# EasyEDA Pro project 轮足机器人主板&核心板.epro, schematic 卡座主板原理图
Board Name: 卡座主板; Create Date: 2024-11-25; Page Name: P1; Project Name: 轮足机器人; Schematic Name: 卡座主板原理图; Update Date: 2025-02-25; Company: 嘉立创EDA; Page Size: A4; Version: V0.1
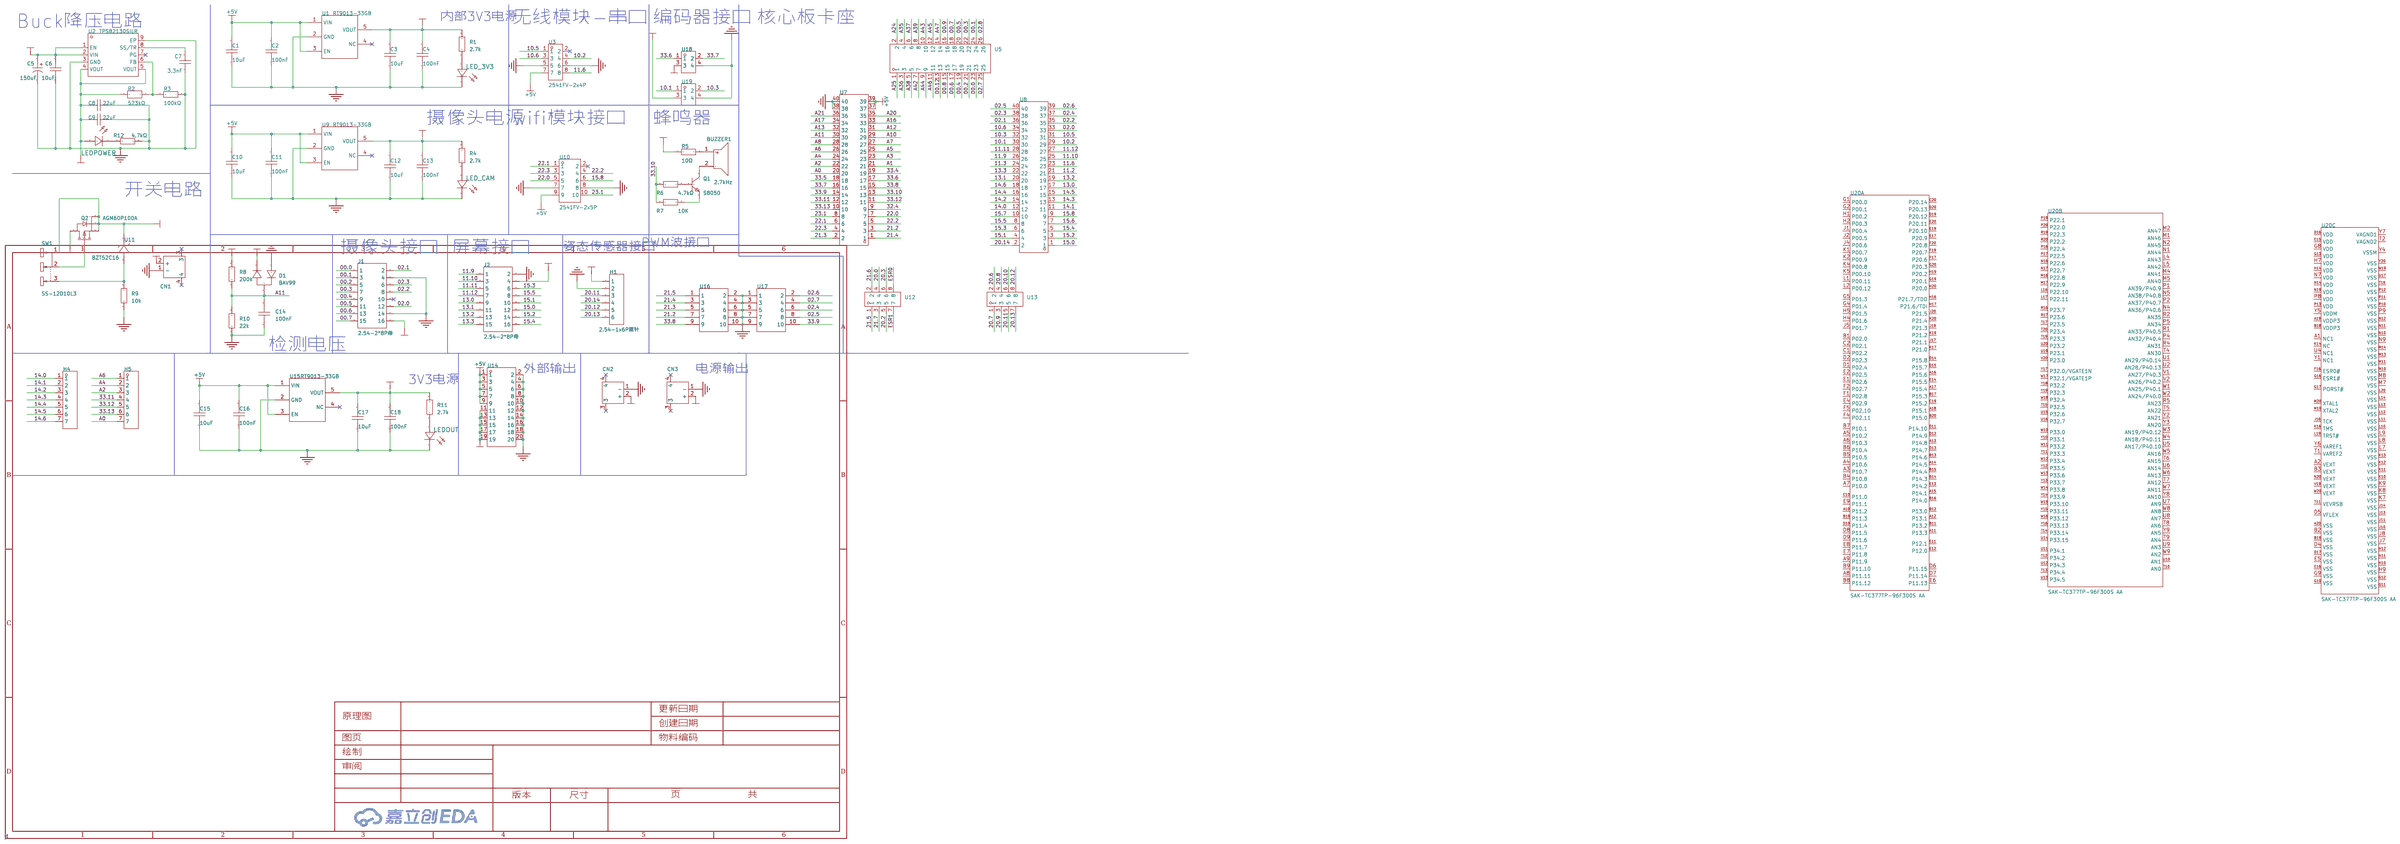
[diagram p2: schematic sheet]

## Parts
BUZZER1  2.7kHz  [BUZ-TH_BD9.0-P4.00-D0.6-FD]
C1  10uF  [C1206]
C2  100nF  [C0603]
C3  10uF  [C1206]
C4  100nF  [C0603]
C5  150uF  [CAP-TH_BD6.3-P2.50-D0.5-FD]
C6  10uF  [C1206]
C7  3.3nF  [C0603]
C8  22uF  [C0805]
C9  22uF  [C0805]
C10  10uF  [C1206]
C11  100nF  [C0603]
C12  10uF  [C1206]
C13  100nF  [C0603]
C14  100nF  [C0603]
C15  10uF  [C1206]
C16  100nF  [C0603]
C17  10uF  [C1206]
C18  100nF  [C0603]
CN1  XT30PW-M30.G.Y  [CONN-TH_XT30PW-M]
CN2  XT30PW-M30.G.Y  [CONN-TH_XT30PW-M]
CN3  XT30PW-M30.G.Y  [CONN-TH_XT30PW-M]
D1  BAV99  [SOT-23_L2.9-W1.3-P1.90-LS2.4-BR]
H1  2.54-1x6P直针  [HDR-TH_6P-P2.54-V-M-1]
H4  PZ254V-11-07P  [HDR-TH_7P-P2.54-V-M]
H5  PZ254V-11-07P  [HDR-TH_7P-P2.54-V-M]
J1  2.54-2*8P母  [HDR-TH_16P-P2.54-V-F-R2-C8-S2.54]
J2  2.54-2*8P母  [HDR-TH_16P-P2.54-V-F-R2-C8-S2.54]
LED_3V3  -  [LED_0603]
LED_CAM  -  [LED_0603]
LEDOUT  -  [LED_0603]
LEDPOWER  -  [LED_0603]
Q1  S8050  [SOT-23-3_L2.9-W1.6-P1.90-LS2.8-BR]
Q2  AGM60P100A  [TDSON-8_L5.9-W5.2-P1.27-BL]
R1  2.7k  [R0603]
R2  523kΩ  [R0603]
R3  100kΩ  [R0603]
R4  2.7k  [R0603]
R5  10Ω  [R0603]
R6  4.7kΩ  [R0603]
R7  10K  [R0603]
R8  200k  [R0603]
R9  10k  [R0603]
R10  22k  [R0603]
R11  2.7k  [R0603]
R12  4.7kΩ  [R0805]
SW1  SS-12D10L3  [SW-TH_SS-12D10L3]
U1  RT9013-33GB  [SOT-23-5_L3.0-W1.7-P0.95-LS2.8-BL]
U2  TPS82130SILR  [USIP-8_L3.0-W2.8-P0.65-TL-EP]
U3  2541FV-2x4P  [HDR-TH_8P-P2.54-V-F-R2-C4-S2.54]
U5  PM254-2-13-Z-8.5  [HDR-TH_26P-P2.54-V-F-R2-C13-S2.54-1]
U7  PM254-2-20-Z-8.5  [HDR-TH_40P-P2.54-V-F-R2-C20-S2.54]
U8  PM254-2-20-Z-8.5  [HDR-TH_40P-P2.54-V-F-R2-C20-S2.54]
U9  RT9013-33GB  [SOT-23-5_L3.0-W1.7-P0.95-LS2.8-BL]
U10  2541FV-2x5P  [HDR-TH_10P-P2.54-V-F-R2-C5-S2.54]
U11  BZT52C16  [SOD-123_L2.7-W1.6-LS3.8-RD]
U12  PM254-2-04-Z-8.5  [HDR-TH_8P-P2.54-V-F-R2-C4-S2.54]
U13  PM254-2-04-Z-8.5  [HDR-TH_8P-P2.54-V-F-R2-C4-S2.54]
U14  2541WV-2x10P  [HDR-TH_20P-P2.54-V-M-R2-C10-S2.54]
U15  RT9013-33GB  [SOT-23-5_L3.0-W1.7-P0.95-LS2.8-BL]
U16  A2541WV-2x5P  [HDR-TH_10P-P2.54-V-M-R2-C5-S2.54-1]
U17  A2541WV-2x5P  [HDR-TH_10P-P2.54-V-M-R2-C5-S2.54-1]
U18  KH-2.54PH180-2X2P-L11.5  [HDR-TH_4P-P2.54-V-M-R2-C2-S2.54]
U19  KH-2.54PH180-2X2P-L11.5  [HDR-TH_4P-P2.54-V-M-R2-C2-S2.54]
U20  SAK-TC377TP-96F300S AA  [PG-LFBGA-292_L17.0-W17.0-BL_SAK-TC1791F]  (sections 1,2,3)

## Library data of the parts
BUZZER1 = QMB-09B-03: 驱动方式:无源(外部驱动);构造类型:电磁式;频率:2.7kHz;声压(SPL):85dB@3V,10cm;; LCSC Part Name: 无源蜂鸣器QMB-09B-03; Supplier Part: C96256; Manufacturer: 华能; Supplier Footprint: 插件,D=9mm; JLCPCB Part Class: 扩展库; Datasheet: https://atta.szlcsc.com/upload/public/pdf/source/20210401/C96256_958B17753B5AD7CBFBCFFC7C095B4484.pdf; Supplier: LCSC; Oscillator Circuit: 无源(外部驱动); Technology Type: 电磁式; Operating Voltage: 2V~5V; Sound Pressure Level (SPL): 85dB@3V,10cm; Diameter (φD): 9mm; Height: 5.7mm
C1 C3 C6 C10 C12 C15 C17 = HGC1206R5106K500NSPJ: 容值:10uF;精度:±10%;额定电压:50V;材质(温度系数):X5R;; LCSC Part Name: 10uF ±10% 50V; Supplier Part: C7432781; Manufacturer: Chinocera(华瓷); Supplier Footprint: 1206; JLCPCB Part Class: 扩展库; Datasheet: https://atta.szlcsc.com/upload/public/pdf/source/20240320/FAC3FEC40A78BC5CCCE96C232A94D860.pdf; Supplier: LCSC; Tolerance: ±10%; Voltage Rated: 50V; Temperature Coefficient: X5R
C2 C4 C11 C13 C16 C18 = CC0603KRX7R9BB104: 容值:100nF;精度:±10%;额定电压:50V;材质(温度系数):X7R;; LCSC Part Name: 100nF ±10% 50V; Supplier Part: C14663; Manufacturer: YAGEO(国巨); Supplier Footprint: 0603; JLCPCB Part Class: 基础库; Datasheet: https://atta.szlcsc.com/upload/public/pdf/source/20180910/C282072_33301C7F631E79921B82A8DAC6BCC5B3.pdf; Supplier: LCSC; Tolerance: ±10%; Voltage Rated: 50V; Temperature Coefficient: X7R
C5 = HG1V157M0609PC: 容值:150uF;精度:±20%;额定电压:35V;纹波电流:2.55A;等效串联电阻:38mΩ;; LCSC Part Name: 150uF ±20% 35V; Supplier Part: C5438852; Manufacturer: HONOR(荣誉); Supplier Footprint: 插件,D6.3xL9mm; JLCPCB Part Class: 扩展库; Datasheet: https://atta.szlcsc.com/upload/public/pdf/source/20230323/E6B46A248FBB182638B68380B3289E6D.pdf; Supplier: LCSC; Tolerance: ±20%; Rated Voltage: 35V; Ripple Current: 2.55A; Equivalent Series Resistance(ESR): 38mΩ; Lead Spacing: 2.5mm; φD: 6.3mm; L: 9mm; Lifetime @ Temp: 2000hrs@105℃; Operating Temperature: -55℃~+105℃
C7 = CL10B332KB8NNNC: 容值:3.3nF;精度:±10%;额定电压:50V;材质(温度系数):X7R;; LCSC Part Name: 3.3nF ±10% 50V; Supplier Part: C1613; Manufacturer: SAMSUNG(三星); Supplier Footprint: 0603; JLCPCB Part Class: 基础库; Datasheet: https://atta.szlcsc.com/upload/public/pdf/source/20160218/1457707763339.pdf; Supplier: LCSC; Tolerance: ±10%; Voltage Rated: 50V; Temperature Coefficient: X7R
C8 C9 = GRM21BR61E226ME44L: 容值:22uF;精度:±20%;额定电压:25V;材质(温度系数):X5R;; LCSC Part Name: 22uF ±20% 25V; Supplier Part: C86816; Manufacturer: muRata(村田); Supplier Footprint: 0805; JLCPCB Part Class: 扩展库; Datasheet: https://atta.szlcsc.com/upload/public/pdf/source/20161226/1482720145536.pdf; Supplier: LCSC; Tolerance: ±20%; Voltage Rated: 25V; Temperature Coefficient: X5R
C14 = CAP_0603: Supplier Footprint: 0603
CN1-CN3 = XT30PW-M30.G.Y: 类别:-;类型1:-;; LCSC Part Name: AMASS(艾迈斯)航模插头 卧式弯脚 XT30PW-M公头; Supplier Part: C431092; Manufacturer: AMASS(艾迈斯); JLCPCB Part Class: 扩展库; Datasheet: https://atta.szlcsc.com/upload/public/pdf/source/20220222/6A9F22F7850E25B33E1BE430ADF8560B.pdf; Supplier: LCSC; Type: 航模插头; RatedVoltage: DC 500V; InterfaceType: 公头; RatedCurrent: 15A; RecommendedWireGauge: 16/18/20AWG; contact resistance: 1.2mΩ; specifications: 2pin
D1 = BAV99_C408392: 二极管配置:1对串联式;正向压降(Vf):1.25V@150mA;直流反向耐压(Vr):70V;整流电流:200mA;反向恢复时间(trr):6ns;; LCSC Part Name: 电压:70V 电流:200mA; Supplier Part: C408392; Manufacturer: MDD(辰达半导体); Supplier Footprint: SOT-23; JLCPCB Part Class: 扩展库; Datasheet: https://atta.szlcsc.com/upload/public/pdf/source/20240710/712A41600A6652723ABF2FD56C16FE3C.pdf; Supplier: LCSC; Diode Configuration: 1对串联式; Forward Voltage (Vf@If): 1.25V@150mA; Reverse Voltage (Vr): 70V; Rectified Current: 200mA; Reverse Leakage Current: 2.5uA@70V; Reverse Recovery Time (trr): 6ns
H1 = 2.54-1x6P直针: 插针结构:1x6P;间距:2.54mm;行距:-;圆针/方针:方针;安装类型:直插;排数:单排;总PIN位数:6P;额定电流:3A;额定电压:-;配合针长度:-;塑高:-;触头材质:黄铜;触头镀层:-;工作温度范围:-40℃~+105℃;颜色:黑色;; LCSC Part Name: 间距:2.54mm 1x6P 直插 方针; Supplier Part: C37208; Manufacturer: BOOMELE(博穆精密); Supplier Footprint: 插件,P=2.54mm; JLCPCB Part Class: 扩展库; Supplier: LCSC; Pin Structure: 1x6P; Pitch: 2.54mm; Circluar Pins/Square Pins: 方针; Mounting Type: 直插; Number of Rows: 单排; Number of Pins: 6P; Current Rating (Max): 3A; Contact Material: 黄铜; Operating Temperature Range: -40℃~+105℃; Color: 黑色
H4 H5 = PZ254V-11-07P: 插针结构:1x7P;间距:2.54mm;行距:-;圆针/方针:方针;安装类型:直插;排数:单排;总PIN位数:7P;额定电流:-;额定电压:-;配合针长度:6mm;塑高:2.5mm;端接针长度:3mm;触头材质:黄铜;触头镀层:-;工作温度范围:-40℃~+105℃;颜色:黑色;; LCSC Part Name: 间距:2.54mm 1x7P 直插 方针; Supplier Part: C492406; Manufacturer: XFCN(兴飞); Supplier Footprint: 插件,P=2.54mm; JLCPCB Part Class: 扩展库; Datasheet: https://atta.szlcsc.com/upload/public/pdf/source/20200309/C492406_654C533EE691117E22DD9F76C114C2D9.pdf; Supplier: LCSC; Pin Structure: 1x7P; Pitch: 2.54mm; Circluar Pins/Square Pins: 方针; Mounting Type: 直插; Number of Rows: 单排; Number of Pins: 7P; Length of Mating Pin: 6mm; Insulation Height: 2.5mm; Length of End Connection Pin: 3mm; Contact Material: 黄铜; Operating Temperature Range: -40℃~+105℃; Color: 黑色
J1 J2 = 2.54-2*8P母: 插孔结构:2x8P;间距:2.54mm;行距:2.54mm;安装类型:直插;排数:双排;总孔位数:16P;塑高:-;触头材质:黄铜;触头镀层:-;; LCSC Part Name: 间距:2.54mm 2x8P 直插; Supplier Part: C30734; Manufacturer: BOOMELE(博穆精密); Supplier Footprint: 插件,P=2.54mm; JLCPCB Part Class: 扩展库; Datasheet: https://atta.szlcsc.com/upload/public/pdf/source/20230817/400B44B2F3F98035DBB6B63900A9163B.pdf; Supplier: LCSC; Holes Structure: 2x8P; Pitch: 2.54mm; Row Spacing: 2.54mm; Mounting Type: 直插; Number of Rows: 双排; Number of Holes: 16P; Contact Material: 黄铜
LED_3V3 LED_CAM LEDOUT LEDPOWER = LED_0603-R: Supplier Footprint: 0603
Q1 = S8050_C181158: 晶体管类型:NPN;集电极电流(Ic):500mA;集射极击穿电压(Vceo):25V;功率(Pd):300mW;; LCSC Part Name: NPN 电流:500mA 耐压:25V; Supplier Part: C181158; Manufacturer: Hottech(合科泰); Supplier Footprint: SOT-23; JLCPCB Part Class: 扩展库; Datasheet: https://atta.szlcsc.com/upload/public/pdf/source/20220506/D987F39D56F2975D34EC7947E75C4ABC.pdf; Supplier: LCSC; Transistor Type: NPN; Collector Current (Ic): 500mA; Collector-Emitter Breakdown Voltage (Vceo): 25V; Power Dissipation (Pd): 300mW; Transition Frequency (fT): 150MHz; Collector Cut-Off Current (Icbo): 100nA; Collector-Emitter Saturation Voltage (VCE(sat)@Ic,Ib): 600mV@500mA,50mA
Q2 = AGM60P100A: 类型:1个P沟道;漏源电压(Vdss):60V;连续漏极电流(Id):100A;导通电阻(RDS(on)@Vgs,Id):5.5mΩ@10V,15A;功率(Pd):150W;阈值电压(Vgs(th)@Id):2V@250uA;; LCSC Part Name: 1个P沟道 耐压:60V 电流:100A; Supplier Part: C5373096; Manufacturer: AGM-Semi(芯控源); Supplier Footprint: PDFN-8(5x6); JLCPCB Part Class: 扩展库; Datasheet: https://atta.szlcsc.com/upload/public/pdf/source/20241108/A068B77F4A82E836D758702AA2819D88.pdf; Supplier: LCSC; Type: 1个P沟道; Drain Source Voltage (Vdss): 60V; Continuous Drain Current (Id): 100A; Drain Source On Resistance (RDS(on)@Vgs,Id): 5.5mΩ@10V,15A; Power Dissipation (Pd): 150W; Gate Threshold Voltage (Vgs(th)@Id): 2V@250uA; Total Gate Charge (Qg@Vgs): 56nC@10V; Operating Temperature: -55℃~+150℃@(Tj)
R1 R4 R7-R11 = Res_0603: Supplier Footprint: 0603
R2 = FRC0603F5233TS: 电阻类型:厚膜电阻;阻值:523kΩ;精度:±1%;功率:100mW;最大工作电压:75V;温度系数:±100ppm/℃;; LCSC Part Name: 523kΩ ±1% 100mW 厚膜电阻; Supplier Part: C5126197; Manufacturer: FOJAN(富捷); Supplier Footprint: 0603; JLCPCB Part Class: 扩展库; Datasheet: https://atta.szlcsc.com/upload/public/pdf/source/20211221/925EC7D7225764EE0046F22065062C87.pdf; Supplier: LCSC; Type: 厚膜电阻; Tolerance: ±1%; Power(Watts): 100mW; Overload Voltage (Max): 75V; Temperature Coefficient: ±100ppm/℃
R3 = RC0603FR-07100KL: 电阻类型:厚膜电阻;阻值:100kΩ;精度:±1%;功率:100mW;最大工作电压:75V;温度系数:±100ppm/℃;; LCSC Part Name: 厚膜电阻 100kΩ ±1% 100mW; Supplier Part: C14675; Manufacturer: YAGEO(国巨); Supplier Footprint: 0603; JLCPCB Part Class: 扩展库; Datasheet: https://atta.szlcsc.com/upload/public/pdf/source/20140324/1457707028752.pdf; Supplier: LCSC; Type: 厚膜电阻; Tolerance: ±1%; Power(Watts): 100mW; Overload Voltage (Max): 75V; Temperature Coefficient: ±100ppm/℃; Operating Temperature Range: -55℃~+155℃
R5 = 0603WAF100JT5E: 电阻类型:厚膜电阻;阻值:10Ω;精度:±1%;功率:100mW;最大工作电压:75V;温度系数:±400ppm/℃;; LCSC Part Name: 10Ω ±1% 100mW 厚膜电阻; Supplier Part: C22859; Manufacturer: UNI-ROYAL(厚声); Supplier Footprint: 0603; JLCPCB Part Class: 基础库; Datasheet: https://atta.szlcsc.com/upload/public/pdf/source/20200306/C422600_1E6D84923E4A46A82E41ADD87F860B5C.pdf; Supplier: LCSC; Type: 厚膜电阻; Tolerance: ±1%; Power(Watts): 100mW; Overload Voltage (Max): 75V; Temperature Coefficient: ±400ppm/℃; Operating Temperature Range: -55℃~+155℃
R6 = 0603WAF4701T5E: 电阻类型:厚膜电阻;阻值:4.7kΩ;精度:±1%;功率:100mW;最大工作电压:75V;温度系数:±100ppm/℃;; LCSC Part Name: 4.7kΩ ±1% 100mW 厚膜电阻; Supplier Part: C23162; Manufacturer: UNI-ROYAL(厚声); Supplier Footprint: 0603; JLCPCB Part Class: 基础库; Datasheet: https://atta.szlcsc.com/upload/public/pdf/source/20200306/C422600_1E6D84923E4A46A82E41ADD87F860B5C.pdf; Supplier: LCSC; Type: 厚膜电阻; Tolerance: ±1%; Power(Watts): 100mW; Overload Voltage (Max): 75V; Temperature Coefficient: ±100ppm/℃; Operating Temperature Range: -55℃~+155℃
R12 = 0805W8F4701T5E: 电阻类型:厚膜电阻;阻值:4.7kΩ;精度:±1%;功率:125mW;最大工作电压:150V;温度系数:±100ppm/℃;; LCSC Part Name: 4.7kΩ ±1% 125mW 厚膜电阻; Supplier Part: C17673; Manufacturer: UNI-ROYAL(厚声); Supplier Footprint: 0805; JLCPCB Part Class: 基础库; Datasheet: https://atta.szlcsc.com/upload/public/pdf/source/20200306/C422600_1E6D84923E4A46A82E41ADD87F860B5C.pdf; Supplier: LCSC; Type: 厚膜电阻; Tolerance: ±1%; Power(Watts): 125mW; Overload Voltage (Max): 150V; Temperature Coefficient: ±100ppm/℃; Operating Temperature Range: -55℃~+155℃
SW1 = SS-12D10L3: 电路结构:单刀双掷;安装方式:直插;开关颜色:黑色;额定电流(DC):3A;额定电压(DC):125V;额定电流(AC):3A;额定电压(AC):125V;机械寿命:1万次;; LCSC Part Name: 柄长3mm 直插双档 滑动开关; Supplier Part: C319013; Manufacturer: XKB Connectivity(中国星坤); Supplier Footprint: 插件; JLCPCB Part Class: 扩展库; Datasheet: https://atta.szlcsc.com/upload/public/pdf/source/20211009/D6412F37AABE6F9459A6EE7FA4DAEADB.pdf; Supplier: LCSC; Circuit: 单刀双掷; Actuator Style: 矩形柱状; Pin Style: PC引脚; Switch Length: 13mm; Switch Width: 6.8mm; Switch Height: 6.4mm; Mounting Style: 直插; Actuator Color: 黑色; Current Rating (DC): 3A; Voltage Rating (DC): 125V; Current Rating (AC): 3A; Voltage Rating (AC): 125V; Mechanical Life: 1万次; Operating Temperature: -40℃~+85℃
U1 U9 U15 = RT9013-33GB: 输出类型:固定;最大输入电压:5.5V;输出电压:3.3V;最大输出电流:500mA;电源纹波抑制比(PSRR):50dB@(10kHz);输出极性:正极;; LCSC Part Name: 输入5.5V 输出3.3V 500mA; Supplier Part: C47773; Manufacturer: RICHTEK(立锜); Supplier Footprint: SOT-23-5; JLCPCB Part Class: 扩展库; Datasheet: https://atta.szlcsc.com/upload/public/pdf/source/20150504/1457707282459.pdf; Supplier: LCSC; Output Type: 固定; Maximum Input Voltage: 5.5V; Output Voltage: 3.3V; MAX Output Current: 500mA; Power Supply Rejection Ratio (PSRR): 50dB@(10kHz); Dropout Voltage: 400mV@(500mA); standby current: 50uA; Operating Temperature: -40℃~+85℃; Output Polarity: 正极; Number of Outputs: 1
U2 = TPS82130SILR: TPS82130 TPS82130 具有集成电感的 3A 17V 降压转换器; Supplier Part: C473914; Manufacturer: TI(德州仪器); Supplier Footprint: USIP-8; JLCPCB Part Class: 扩展库; Datasheet: https://www.ti.com/cn/lit/gpn/tps82130; Supplier: LCSC
U3 = 2541FV-2x4P: 插孔结构:2x4P;间距:2.54mm;圆孔/方孔:方孔;安装类型:直插;排数:双排;总孔位数:8P;额定电流:3A;额定电压:250V;插孔方向:顶部;工作温度范围:-40℃~+105℃;; LCSC Part Name: 间距:2.54mm 2x4P 直插; Supplier Part: C18723055; Manufacturer: HanElectricity(瀚源); Supplier Footprint: 插件,P=2.54mm; JLCPCB Part Class: 扩展库; Datasheet: https://atta.szlcsc.com/upload/public/pdf/source/20231018/348A30CBB18FAA04E40F2CE12A6EAA75.pdf; Supplier: LCSC; Holes Structure: 2x4P; Pitch: 2.54mm; Circular Hole / Square Hole: 方孔; Mounting Type: 直插; Number of Rows: 双排; Number of Holes: 8P; Current Rating (Max): 3A; Voltage Rating (Max): 250V; Holes Direction: 顶部; Operating Temperature Range: -40℃~+105℃
U5 = PM254-2-13-Z-8.5: 插孔结构:2x13P;间距:2.54mm;行距:2.54mm;圆孔/方孔:方孔;安装类型:直插;排数:双排;总孔位数:26P;额定电流:3A;额定电压:-;插孔方向:顶部;塑高:8.5mm;触头材质:铜合金;工作温度范围:-40℃~+105℃;焊接温度(最大值):260℃@5S;; LCSC Part Name: 2x13P 间距:2.54mm 直插; Supplier Part: C2897414; Manufacturer: HCTL(华灿天禄); Supplier Footprint: 插件,P=2.54mm; JLCPCB Part Class: 扩展库; Datasheet: https://atta.szlcsc.com/upload/public/pdf/source/20230609/3D36CA2C1BFC9FD1C3F709AD9DFEB9C2.pdf; Supplier: LCSC; Holes Structure: 2x13P; Pitch: 2.54mm; Row Spacing: 2.54mm; Circular Hole / Square Hole: 方孔; Mounting Type: 直插; Number of Rows: 双排; Number of Holes: 26P; Current Rating (Max): 3A; Holes Direction: 顶部; Insulation Height: 8.5mm; Contact Material: 铜合金; Operating Temperature Range: -40℃~+105℃; Soldering Temperature(Max): 260℃@5S
U7 U8 = PM254-2-20-Z-8.5: 插孔结构:2x20P;间距:2.54mm;行距:2.54mm;圆孔/方孔:方孔;安装类型:直插;排数:双排;总孔位数:40P;额定电流:3A;额定电压:-;插孔方向:顶部;塑高:8.5mm;触头材质:铜合金;工作温度范围:-40℃~+105℃;焊接温度(最大值):260℃@5S;; LCSC Part Name: 2x20P 间距:2.54mm 直插; Supplier Part: C2897421; Manufacturer: HCTL(华灿天禄); Supplier Footprint: 插件,P=2.54mm; JLCPCB Part Class: 扩展库; Datasheet: https://atta.szlcsc.com/upload/public/pdf/source/20230609/3D36CA2C1BFC9FD1C3F709AD9DFEB9C2.pdf; Supplier: LCSC; Holes Structure: 2x20P; Pitch: 2.54mm; Row Spacing: 2.54mm; Circular Hole / Square Hole: 方孔; Mounting Type: 直插; Number of Rows: 双排; Number of Holes: 40P; Current Rating (Max): 3A; Holes Direction: 顶部; Insulation Height: 8.5mm; Contact Material: 铜合金; Operating Temperature Range: -40℃~+105℃; Soldering Temperature(Max): 260℃@5S
U10 = 2541FV-2x5P: 插孔结构:2x5P;间距:2.54mm;圆孔/方孔:方孔;安装类型:直插;排数:双排;总孔位数:10P;额定电流:3A;额定电压:250V;插孔方向:顶部;工作温度范围:-40℃~+105℃;; LCSC Part Name: 间距:2.54mm 2x5P 直插; Supplier Part: C18723056; Manufacturer: HanElectricity(瀚源); Supplier Footprint: 插件,P=2.54mm; JLCPCB Part Class: 扩展库; Datasheet: https://atta.szlcsc.com/upload/public/pdf/source/20231018/348A30CBB18FAA04E40F2CE12A6EAA75.pdf; Supplier: LCSC; Holes Structure: 2x5P; Pitch: 2.54mm; Circular Hole / Square Hole: 方孔; Mounting Type: 直插; Number of Rows: 双排; Number of Holes: 10P; Current Rating (Max): 3A; Voltage Rating (Max): 250V; Holes Direction: 顶部; Operating Temperature Range: -40℃~+105℃
U11 = BZT52C16_C2903915: 二极管配置:独立式;稳压值(标称值):16V;稳压值(范围):15.3V~17.1V;功率(Pd):500mW;; Supplier Part: C2903915; Manufacturer: GOODWORK(固得沃克); Supplier Footprint: SOD-123; JLCPCB Part Class: 扩展库; Datasheet: https://atta.szlcsc.com/upload/public/pdf/source/20211009/D2D840BC467623069B519162AA0DC941.pdf; Supplier: LCSC; Diode Configuration: 独立式; Zener Voltage (Nom): 16V; Reverse Leakage Current (Ir): 100nA@11.2V; Zener Voltage (Range): 15.3V~17.1V; Power Dissipation: 500mW; Zener Impedance (Zzt): 40Ω
U12 U13 = PM254-2-04-Z-8.5: 插孔结构:2x4P;间距:2.54mm;行距:2.54mm;圆孔/方孔:方孔;安装类型:直插;排数:双排;总孔位数:8P;额定电流:3A;额定电压:-;插孔方向:顶部;塑高:8.5mm;触头材质:铜合金;工作温度范围:-40℃~+105℃;焊接温度(最大值):260℃@5S;; LCSC Part Name: 2x4P 间距:2.54mm 直插; Supplier Part: C2897405; Manufacturer: HCTL(华灿天禄); Supplier Footprint: 插件,P=2.54mm; JLCPCB Part Class: 扩展库; Datasheet: https://atta.szlcsc.com/upload/public/pdf/source/20230609/3D36CA2C1BFC9FD1C3F709AD9DFEB9C2.pdf; Supplier: LCSC; Holes Structure: 2x4P; Pitch: 2.54mm; Row Spacing: 2.54mm; Circular Hole / Square Hole: 方孔; Mounting Type: 直插; Number of Rows: 双排; Number of Holes: 8P; Current Rating (Max): 3A; Holes Direction: 顶部; Insulation Height: 8.5mm; Contact Material: 铜合金; Operating Temperature Range: -40℃~+105℃; Soldering Temperature(Max): 260℃@5S
U14 = 2541WV-2x10P: 插针结构:2x10P;间距:2.54mm;安装类型:直插;排数:双排;总PIN位数:20P;配合针长度:6mm;塑高:2.54mm;端接针长度:3mm;; LCSC Part Name: 2x10P 间距:2.54mm 直插; Supplier Part: C5383109; Manufacturer: HanElectricity(瀚源); Supplier Footprint: 插件,P=2.54mm; JLCPCB Part Class: 扩展库; Datasheet: https://atta.szlcsc.com/upload/public/pdf/source/20230330/E6AE37B56C45D0CDA24B058754300644.pdf; Supplier: LCSC; Pin Structure: 2x10P; Pitch: 2.54mm; Mounting Type: 直插; Number of Rows: 双排; Number of Pins: 20P; Length of Mating Pin: 6mm; Insulation Height: 2.54mm; Length of End Connection Pin: 3mm
U16 U17 = A2541WV-2x5P: 插针结构:2x5P;间距:2.54mm;行距:2.54mm;圆针/方针:方针;安装类型:直插;排数:双排;总PIN位数:10P;额定电流:3A;额定电压:250V;配合针长度:6mm;塑高:2.54mm;端接针长度:3mm;触头材质:黄铜;触头镀层:金;工作温度范围:-40℃~+105℃;颜色:黑色;; LCSC Part Name: 2x5P 间距:2.54mm 方针 直插; Supplier Part: C225520; Manufacturer: CJT(长江连接器); Supplier Footprint: 插件,P=2.54mm; JLCPCB Part Class: 扩展库; Datasheet: https://atta.szlcsc.com/upload/public/pdf/source/20180724/C239359_48B1BC0CA1B4E4396A63955AAFD15564.pdf; Supplier: LCSC; Pin Structure: 2x5P; Pitch: 2.54mm; Row Spacing: 2.54mm; Circluar Pins/Square Pins: 方针; Mounting Type: 直插; Number of Rows: 双排; Number of Pins: 10P; Current Rating (Max): 3A; Voltage Rating (Max): 250V; Length of Mating Pin: 6mm; Insulation Height: 2.54mm; Length of End Connection Pin: 3mm; Contact Material: 黄铜; Contact Plating: 金; Operating Temperature Range: -40℃~+105℃; Color: 黑色
U18 U19 = KH-2.54PH180-2X2P-L11.5: 插针结构:2x2P;间距:2.54mm;排数:双排;总PIN位数:4P;塑高:2.5mm;; LCSC Part Name: 2x2P 间距:2.54mm; Supplier Part: C19630931; Manufacturer: kinghelm(金航标); Supplier Footprint: 插件,P=2.54mm; JLCPCB Part Class: 扩展库; Datasheet: https://atta.szlcsc.com/upload/public/pdf/source/20231207/D5CFEC74D989BBD0B54934F3D018DB29.pdf; Supplier: LCSC; Pin Structure: 2x2P; Pitch: 2.54mm; Number of Rows: 双排; Number of Pins: 4P; Insulation Height: 2.5mm
U20 = SAK-TC377TP-96F300S AA: Supplier Part: C538866; Manufacturer: Infineon(英飞凌); Supplier Footprint: LFBGA-292; JLCPCB Part Class: 扩展库; Datasheet: https://atta.szlcsc.com/upload/public/pdf/source/20230201/4817F3AB8052933065390DBFE5F4B895.pdf; Supplier: LCSC

## Nets
+5V: C1.2 C2.2 C8.1 C9.1 C10.2 C11.2 C15.2 C16.2 LEDPOWER.2(A) R2.2 U1.1(VIN) U1.3(EN) U2.4(VOUT) U2.5(VOUT) U3.7 U7.37 U7.39 U9.1(VIN) U9.3(EN) U10.9 U14.1 U14.3 U14.5 U14.7 U14.9 U15.1(VIN) U15.3(EN)
GND: C1.1 C2.1 C3.1 C4.1 C5.2 C6.1 C7.1 C8.2 C9.2 C10.1 C11.1 C12.1 C13.1 C14.1 C15.1 C16.1 C17.1 C18.1 CN1.1(-) CN2.1(-) CN3.1(-) D1.1 H1.2 J1.4 J1.14 J2.2 LED_3V3.1(C) LED_CAM.1(C) LEDOUT.1(C) R3.1 R9.1 R10.1 R12.2 U1.2(GND) U2.3(GND) U2.9(EP) U3.5 U3.6 U7.38 U7.40 U9.2(GND) U10.7 U10.8 U14.2 U14.4 U14.6 U14.8 U14.10 U14.12 U14.14 U14.16 U14.18 U14.20 U15.2(GND) U16.2 U16.4 U16.6 U16.8 U16.10 U17.1 U17.3 U17.5 U17.7 U17.9 U18.4 U19.4
VCC3V3: C3.2 C4.2 H1.1 J2.4 R1.2 U1.5(VOUT) U19.3
VCC3V3OUT: C17.2 C18.2 D1.2 R5.1 R11.2 U14.11 U14.13 U14.15 U14.17 U14.19 U15.5(VOUT) U18.3
VCCCAM: C12.2 C13.2 J1.16 R4.2 U9.5(VOUT)
VIN_BAT: C5.1 C6.2 CN2.2(+) CN3.2(+) Q2.5(D) R8.2 U2.1(EN) U2.2(VIN)
00.0: J1.1 U5.23
00.1: J1.3 U5.24
00.2: J1.5 U5.21
00.3: J1.7 U5.22
00.4: J1.9 U5.19
00.5: J1.11 U5.20
00.6: J1.13 U5.17
00.7: J1.15 U5.18
00.8: U5.15
00.9: U5.16
00.12: U5.13
02.0: J1.12 U8.33
02.1: J1.2 U8.36
02.2: J1.8 U8.35
02.3: J1.6 U8.38
02.4: U8.37 U17.6
02.5: U8.40 U17.8
02.6: U8.39 U17.2
02.7: U5.25 U17.4
02.8: U5.26
10.1: U8.30 U19.1
10.2: U3.4 U8.29
10.3: U8.32 U19.2
10.5: U3.1 U8.31
10.6: U3.3 U8.34
11.2: U8.21
11.3: U8.24
11.6: U3.8 U8.23
11.9: J2.1 U8.26
11.10: J2.3 U8.25
11.11: J2.5 U8.28
11.12: J2.7 U8.27
13.0: J2.9 U8.17
13.1: J2.11 U8.20
13.2: J2.13 U8.19
13.3: J2.15 U8.22
14.0: H4.1 U8.12
14.1: H4.2 U8.11
14.2: H4.3 U8.14
14.3: H4.4 U8.13
14.4: H4.5 U8.16
14.5: H4.6 U8.15
14.6: H4.7 U8.18
15.0: J2.12 U8.1
15.1: J2.10 U8.4
15.2: J2.14 U8.3
15.3: J2.6 U8.6
15.4: J2.16 U8.5
15.5: J2.8 U8.8
15.6: U8.7
15.7: U8.10
15.8: U8.9 U10.6
20.0: U12.4
20.2: U12.5
20.3: U12.6
20.6: U13.2
20.7: U13.1
20.8: U13.4
20.9: U13.3
20.10: U13.6
20.11: H1.3 U13.5
20.12: H1.5 U13.8
20.13: H1.6 U13.7
20.14: H1.4 U8.2
21.2: U7.3 U16.7
21.3: U7.2 U16.5
21.4: U7.1 U16.3
21.5: U12.1 U16.1
21.6: U12.2
21.7: U12.3
22.0: U7.7 U10.5
22.1: U7.6 U10.1
22.2: U7.5 U10.4
22.3: U7.4 U10.3
23.1: U7.8 U10.10
32.4: U7.9
33.4: U7.19
33.5: U7.18
33.6: U7.17 U18.1
33.7: U7.16 U18.2
33.8: U7.15 U16.9
33.9: U7.14 U17.10
33.10: R6.1 R7.1 U7.13
33.11: H5.4 U7.12
33.12: H5.5 U7.11
33.13: H5.6 U7.10
A0: H5.7 U7.20
A1: U7.21
A2: H5.3 U7.22
A3: U7.23
A4: H5.2 U7.24
A5: U7.25
A6: H5.1 U7.26
A7: U7.27
A8: U7.28
A10: U7.29
A11: C14.2 D1.3 R8.1 R10.2 U7.30
A12: U7.31
A13: U7.32
A16: U7.33
A17: U7.34
A20: U7.35
A21: U7.36
A24: U5.2
A25: U5.1
A35: U5.4
A36: U5.3
A37: U5.6
A38: U5.5
A39: U5.8
A42: U5.7
A43: U5.10
A44: U5.9
A45: U5.12
A46: U5.11
A47: U5.14
DCIN: CN1.2(+) Q2.1(S) Q2.2(S) Q2.3(S) SW1.1 U11.1(K)
ESR0: U12.8
ESR1: U12.7
$1N441: C7.2 U2.8(SS/TR)
$1N622: R2.1 R3.2 U2.6(FB)
$1N4409: Q1.2 R7.2
$1N4414: BUZZER1.2 Q1.3
$1N4417: Q1.1 R6.2
$1N4508: BUZZER1.1 R5.2
Net-(LED_3V3-2): LED_3V3.2(A) R1.1
Net-(LED_CAM-2): LED_CAM.2(A) R4.1
Net-(LEDOUT-2): LEDOUT.2(A) R11.1
Net-(LEDPOWER-1): LEDPOWER.1(C) R12.1
Net-(Q2-4): Q2.4(G) SW1.2
Net-(R9-2): R9.2 SW1.3 U11.2(A)

Not connected (* = marked no-connect by the designer): CN1 3* 4*; CN2 3* 4*; CN3 3* 4*; J1 10*; U1 4(NC)*; U2 7(PG)*; U3 2*; U9 4(NC)*; U10 2*; U15 4(NC)*; U20 A1(NC1) A2(VEXT) A3(P10.7) A4(P10.6) A5(P10.2) A6(P10.3) A7(P10.0) A8(P11.11) A9(P11.9) A10(P11.2) A11(P13.3) A12(P13.1) A13(P14.8) A14(P14.5) A15(P14.1) A16(P15.6) A17(P15.4) A18(P15.1) A19(VDDP3) A20(VSS) B1(P02.0) B2(VSS) B3(VEXT) B4(P10.8) B5(P10.5) B6(P10.4) B7(P10.1) B8(P11.12) B9(P11.10) B10(P11.3) B11(P13.2) B12(P13.0) B13(P14.6) B14(P14.3) B15(P14.4) B16(P14.0) B17(P15.3) B18(VDDP3) B19(VSS) B20(P15.0) C1(P02.2) C2(P02.1) C19(P15.2) C20(P20.14) D1(P02.4) D2(P02.3) D4(VSS) D5(VFLEX) D6(P11.15) D7(P11.14) D8(P11.5) D9(P11.6) D10(P11.4) D11(P14.10) D12(P14.9) D13(P14.7) D14(P15.8) D15(P15.7) D16(VDD) D17(VSS) D19(P20.12) D20(P20.13) E1(P02.6) E2(P02.5) E4(P02.9) E5(VSS) E6(P11.13) E7(P11.8) E8(P11.7) E9(P11.1) E10(P11.0) E11(P12.1) E12(P12.0) E13(P14.2) E14(P15.5) E15(VDD) E16(VSS) E17(P20.9) E19(P20.10) E20(P20.11) F1(P02.8) F2(P02.7) F4(P02.11) F5(P02.10) F16(ESR0#) F17(P20.6) F19(P20.7) F20(P20.8) G1(P00.0) G2(P00.1) G4(P01.4) G5(P01.3) G8(VDD) G9(VSS) G10(VSS) G11(VSS) G12(VSS) G13(VDD) G16(ESR1#) G17(PORST#) G19(P20.1) G20(P20.3) H1(P00.2) H2(P00.3) H4(P01.6) H5(P01.5) H7(VDD) H9(VSS) H10(VSS) H11(VSS) H12(VSS) H14(VDD) H16(P21.7/TDO) H17(P21.6/TDI) H19(P20.2) H20(P20.0) J1(P00.4) J2(P00.5) J4(P00.6) J5(P01.7) J7(VSS) J8(VSS) J10(VSS) J11(VSS) J13(VSS) J14(VSS) J16(TCK) J17(P21.1) J19(P21.3) J20(P21.5) K1(P00.7) K2(P00.9) K4(P00.8) K5(P00.10) K7(VSS) K8(VSS) K9(VSS) K10(VSS) K11(VSS) K12(VSS) K13(VSS) K14(NC) K16(TMS) K17(P21.0) K19(P21.2) K20(P21.4) L1(P00.11) L2(P00.12) L4(AN43) L5(AN42) L7(VSS) L8(VSS) L9(VSS) L10(VSS) L11(VSS) L12(VSS) L13(VSS) L14(VSS) L16(P22.10) L17(P22.11) L19(TRST#) L20(VSS) M1(AN46) M2(AN47) M4(AN41) M5(AN40) M7(VSS) M8(VSS) M10(VSS) M11(VSS) M13(VSS) M14(VSS) M16(P22.8) M17(P22.9) M19(XTAL2) M20(XTAL1) N1(AN44) N2(AN45) N4(AN36/P40.6) N5(AN38/P40.8) N7(VDD) N9(VSS) N10(VSS) N11(VSS) N12(VSS) N14(VDD) N16(P22.6) N17(P22.7) N19(VDD) N20(VEXT) P1(AN39/P40.9) P2(AN37/P40.7) P4(AN32/P40.4) P5(AN34) P8(VDD) P9(VSS) P10(VSS) P11(VSS) P12(VSS) P13(VDD) P16(P22.4) P17(P22.5) P19(P22.1) P20(P22.0) R1(AN33/P40.5) R2(AN35) R4(AN31) R5(AN23) R16(P23.7) R17(P23.6) R19(P22.3) R20(P22.2) T1(VAREF2) T2(VAGND2) T4(AN30) T5(AN22) T6(AN15) T7(AN12) T8(AN6) T9(AN4) T10(AN0) T11(VEVRSB) T12(P34.2) T13(P34.4) T14(P33.14) T15(P32.5) T16(VSS) T17(P23.5) T19(P23.3) T20(P23.4) U1(AN29/P40.14) U2(AN28/P40.13) U4(NC1) U5(AN17/P40.10) U6(AN14) U7(AN9) U8(AN7) U9(AN3) U10(AN1) U11(P34.1) U12(P34.3) U13(P34.5) U14(P33.15) U15(P32.6) U16(P32.7) U17(VSS) U19(P23.1) U20(P23.2) V1(AN27/P40.3) V2(AN26/P40.2) V19(VEXT) V20(P23.0) W1(AN25/P40.1) W2(AN24/P40.0) W3(AN19/P40.12) W4(AN18/P40.11) W5(AN16) W6(AN13) W7(AN11) W8(AN8) W9(AN2) W10(P33.0) W11(P33.2) W12(P33.4) W13(P33.6) W14(P33.8) W15(P33.10) W16(P33.12) W17(P32.1/VGATE1P) W18(P32.4) W19(VSS) W20(VEXT) Y1(NC1) Y2(AN21) Y3(AN20) Y4(VSSM) Y5(VDDM) Y6(VAREF1) Y7(VAGND1) Y8(AN10) Y9(AN5) Y10(P33.1) Y11(P33.3) Y12(P33.5) Y13(P33.7) Y14(P33.9) Y15(P33.11) Y16(P33.13) Y17(P32.0/VGATE1N) Y18(P32.2) Y19(P32.3) Y20(VSS)

## Notes on the sheet
- 内部3V3电源
- Buck降压电路
- 无线模块-串口
- 编码器接口
- 核心板卡座
- 摄像头电源
- wifi模块接口
- 蜂鸣器
- 开关电路
- PWM波接口
- 姿态传感器接口
- 摄像头接口
- 屏幕接口
- 检测电压
- 外部输出
- 电源输出
- 3V3电源
